# Altium project nira_avr_dev_board.PrjPcb (part 1 of 2)
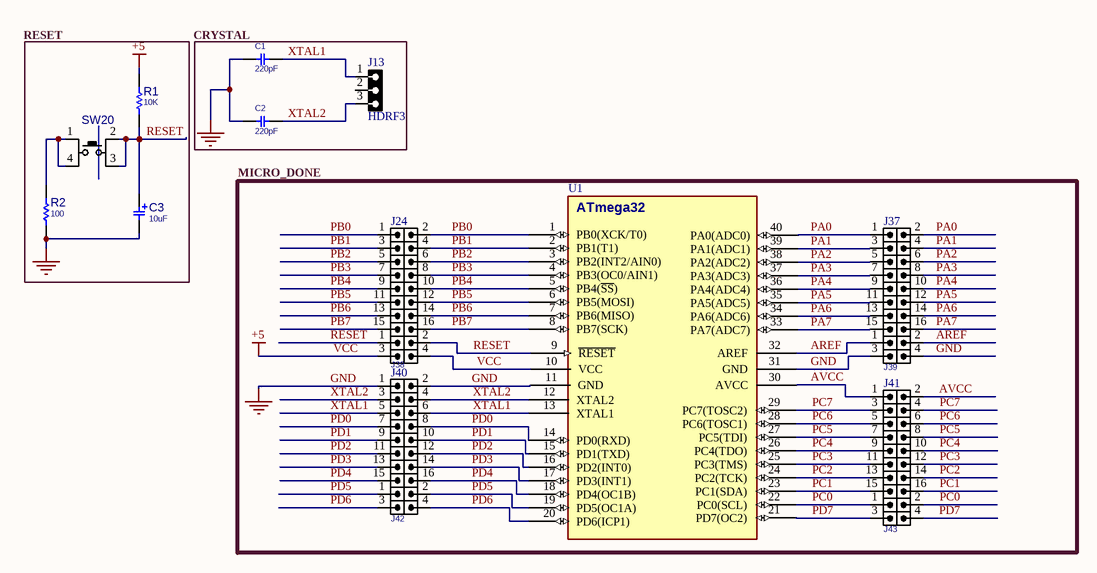
[diagram p0: main.SchDoc]
25 sheets, 197 parts. Net scope: global (net labels, ports and power ports of the same name join across sheets).
Board file: main.PcbDoc
Sheets:
  main.SchDoc
  rs232_usart.SchDoc
  stepper_motor.SchDoc
  dc_motor.SchDoc
  relay.SchDoc
  lcd_16_2.SchDoc
  glcd_128_64.SchDoc
  seven_segment.SchDoc
  push_button.SchDoc
  keypad.SchDoc
  pull_up_pull_down_switch.SchDoc
  temp_lm35.SchDoc
  buzzer.SchDoc
  led.SchDoc
  eeprom.SchDoc
  rtc.SchDoc
  rgb_led.SchDoc
  mmc_sd.SchDoc
  ps2_connector.SchDoc
  infra_red.SchDoc
  digital_pot.SchDoc
  phase_locked_loop.SchDoc
  rs485.SchDoc
  power.SchDoc
  programmer.SchDoc

## Sheet main.SchDoc
size A4; Engineer: Amir Hossein Jobeiri; Organization: Simaran; SheetNumber: 1; SheetTotal: 25

### Parts
C1  220pF  [C_CER_D3]
C2  220pF  [C_CER_D3]
C3  10uF  [C_EL_8X12]
J13  HDRF3  [HDR_F_1X3]
J24  HDRM_2X8  [HDR_M_2X8]  (value not drawn)
J37  HDRM_2X8  [HDR_M_2X8]  (value not drawn)
J38  HDRM_2X2  [HDR_M_2X2]  (value not drawn)
J39  HDRM_2X2  [HDR_M_2X2]  (value not drawn)
J40  HDRM_2X8  [HDR_M_2X8]  (value not drawn)
J41  HDRM_2X8  [HDR_M_2X8]  (value not drawn)
J42  HDRM_2X2  [HDR_M_2X2]  (value not drawn)
J43  HDRM_2X2  [HDR_M_2X2]  (value not drawn)
R1  10K  [R025W_AX04]
R2  100  [R025W_AX04]
SW20  PUSHBUTTON  [SWPBT_SPDT_6X6X5]  (value not drawn)
U1  ATMEGA32  [DIP_40DW]  (value not drawn)

### Blocks framed on the sheet
RESET: C3 R1 R2 SW20
CRYSTAL: C1 C2 J13
MICRO_DONE: J24 J37-J43 U1

### Nets
+5: J38.3 J38.4 R1.2 U1.10(VCC)  [also labelled VCC]  [project net LEDA_]
GND: C1.2 C2.2 C3.2 J39.3 J39.4 J40.1 J40.2 R2.1 U1.11(GND) U1.31(GND)
AREF: J39.1 J39.2 U1.32(AREF)
AVCC: J41.1 J41.2 U1.30(AVCC)
PA0: J37.1 J37.2 U1.40(PA0(ADC0))
PA1: J37.3 J37.4 U1.39(PA1(ADC1))
PA2: J37.5 J37.6 U1.38(PA2(ADC2))
PA3: J37.7 J37.8 U1.37(PA3(ADC3))
PA4: J37.9 J37.10 U1.36(PA4(ADC4))
PA5: J37.11 J37.12 U1.35(PA5(ADC5))
PA6: J37.13 J37.14 U1.34(PA6(ADC6))
PA7: J37.15 J37.16 U1.33(PA7(ADC7))
PB0: J24.1 J24.2 U1.1(PB0(XCK/T0))
PB1: J24.3 J24.4 U1.2(PB1(T1))
PB2: J24.5 J24.6 U1.3(PB2(INT2/AIN0))
PB3: J24.7 J24.8 U1.4(PB3(OC0/AIN1))
PB4: J24.9 J24.10 U1.5(PB4(~{SS}))
PB5: J24.11 J24.12 U1.6(PB5(MOSI))
PB6: J24.13 J24.14 U1.7(PB6(MISO))
PB7: J24.15 J24.16 U1.8(PB7(SCK))
PC0: J43.1 J43.2 U1.22(PC0(SCL))
PC1: J41.15 J41.16 U1.23(PC1(SDA))
PC2: J41.13 J41.14 U1.24(PC2(TCK))
PC3: J41.11 J41.12 U1.25(PC3(TMS))
PC4: J41.9 J41.10 U1.26(PC4(TDO))
PC5: J41.7 J41.8 U1.27(PC5(TDI))
PC6: J41.5 J41.6 U1.28(PC6(TOSC1))
PC7: J41.3 J41.4 U1.29(PC7(TOSC2))
PD0: J40.7 J40.8 U1.14(PD0(RXD))
PD1: J40.9 J40.10 U1.15(PD1(TXD))
PD2: J40.11 J40.12 U1.16(PD2(INT0))
PD3: J40.13 J40.14 U1.17(PD3(INT1))
PD4: J40.15 J40.16 U1.18(PD4(OC1B))
PD5: J42.1 J42.2 U1.19(PD5(OC1A))
PD6: J42.3 J42.4 U1.20(PD6(ICP1))
PD7: J43.3 J43.4 U1.21(PD7(OC2))
RESET: C3.1 J38.1 J38.2 R1.1 SW20.2(P3) SW20.3(P4) U1.9(~{RESET})
XTAL1: C1.1 J13.1 J40.5 J40.6 U1.13(XTAL1)
XTAL2: C2.1 J13.3 J40.3 J40.4 U1.12(XTAL2)
NetR2_2: R2.2 SW20.1(P1) SW20.4(P2)

Not connected (* = marked no-connect by the designer): J13 2

### Notes on the sheet
- (in symbol ATMEGA32A_DIP40) ATmega32

### Library data of the parts
C1 C2 = CAP_THD_CERML: CAP, THD, CER MULTI LAYER,; PARAM: 50V; DESC: CAP, CER MULTI LAYER,; MANF_P#: MANF_PART#; PRICE: 100= 1$; MANF: MANF; PARAM2: PARAM2; ASSEMBLY: ASSEMBLY; VALUE: 220pF
C3 = CAP_THD_EL: CAP, THD, ELEC,; MANF_P#: MANF_PART#; PARAM2: 25V; DESC: DESCRIPTION; DIST#: MOUSER; PARAM: 20%; PRICE: 10= 5$; MANF: MANF; ASSEMBLY: ASSEMBLY; VALUE: 10uF
J13 = HDR_F_1X3: CONN, HEADER, Female, pitch: 2.54mm, 3POS; VALUE: HDRF3
J24 J37 J40 J41 = HDR_M_2X8: CONN, HEADER, Male, pitch: 2.54mm, 16POS; VALUE: HDRM_2X8
J38 J39 J42 J43 = HDR_M_2X2: CONN, HEADER, Male, pitch: 2.54mm, 4POS; MANF_P#: MANF_PART#; MANF: MANF; VALUE: HDRM_2X2
R1 R2 = RES_THD: RESISTOR, THD; MANF_P#: RK73H1ETTP4701F; MANF: KOA SPEER; PARAM: 0.063W; DESC: DESCRIPTION; DIST#: MOUSER; PARAM2: 1%; ASSEMBLY: ASSEMBLY; PRICE: 100= 0.5$
  R1: VALUE: 10K
  R2: VALUE: 100
SW20 = SWPBT_SPDT_6X6X5: SWITCH, PUSH BUTTON, TACTILE, THD, SPDT, 4X4MM; DESC: DESCRIPTION; MANF: -; VALUE: PUSHBUTTON; ASSEMBLY: ASSEMBLY; PARAM: PARAM; PRICE: PRICE; MANF_P#: -
U1 = ATMEGA32A_DIP40: MCU, AVR, 8-Bit, 32KB, 2KB RAM, 16MHz; MANF_P#: ATMEGA32A-PU; DESC: 1KB EEPROM; MANF: ATMEL/MICROCHIP; PARAM2: 2.7~5.5V; PARAM: 32KB, 2KB RAM, 16MHz, -40~85°C; PRICE: 3.5$; VALUE: ATMEGA32

## Sheet rs232_usart.SchDoc
size A4; Engineer: Amir Hossein Jobeiri; Organization: Simaran; SheetNumber: 2; SheetTotal: 25
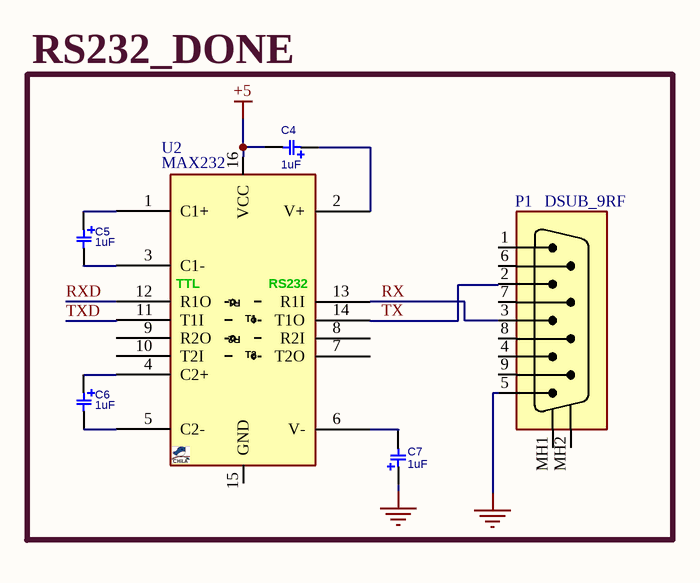
[diagram p1: rs232_usart.SchDoc]

### Parts
C4  1uF  [C_EL_4X7]
C5  1uF  [C_EL_4X7]
C6  1uF  [C_EL_4X7]
C7  1uF  [C_EL_4X7]
P1  DSUB_9RF  [DSUB_9RF]
U2  MAX232  [DIP_16]

### Blocks framed on the sheet
RS232_DONE: C4-C7 P1 U2

### Nets
+5: C4.2 U2.16(VCC)  [project net LEDA_]
GND: C7.1 P1.5
RX: P1.3 U2.13(R1I)
RXD: U2.12(R1O)
TX: P1.2 U2.14(T1O)
TXD: U2.11(T1I)
NetC4_1: C4.1 U2.2(V+)
NetC5_1: C5.1 U2.1(C1+)
NetC5_2: C5.2 U2.3(C1-)
NetC6_1: C6.1 U2.4(C2+)
NetC6_2: C6.2 U2.5(C2-)
NetC7_2: C7.2 U2.6(V-)

Not connected (* = marked no-connect by the designer): P1 1 4 6 7 8 9 MH1 MH2; U2 7(T2O) 8(R2I) 9(R2O) 10(T2I) 15(GND)

### Notes on the sheet
- (in symbol MAX232_DIP16) TTL; RS232; R1; T1; R2; T2

### Library data of the parts
C4-C7 = CAP_THD_EL_10u25V: CAP, THD, ELEC, 10uF, 25V; MANF_P#: MANF_PART#; PARAM: 25V; MANF: MANF; PARAM2: PARAM2; VALUE: 1uF
P1 = CONN_DSUB_9RF: CONN, DSUB, HD, 9PIN, R/A, FEMALE, THD; MANF_P#: -; MANF: -; VALUE: DSUB_9RF
U2 = MAX232_DIP16: RS-232, DUAL, +5V, Driver/Receiver; MANF_PART#: MAX232N, MAX232ACPE; MANF: Texas Instruments, Maxim Integrated; PARAM: PARAM; PRICE: 1500toman@PAYA; VALUE: MAX232

## Sheet stepper_motor.SchDoc
size A4; Engineer: Amir Hossein Jobeiri; Organization: Simaran; SheetNumber: 3; SheetTotal: 25
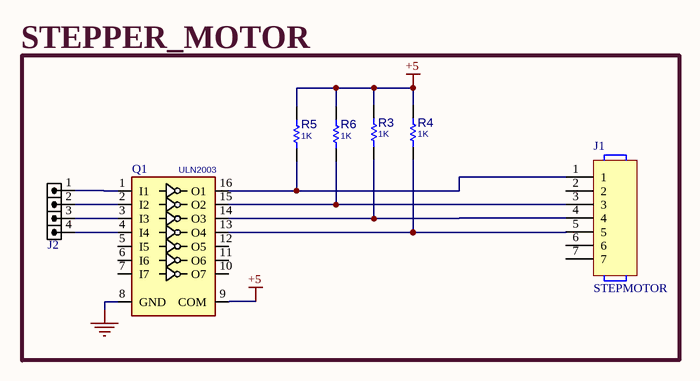
[diagram p2: stepper_motor.SchDoc]

### Parts
J1  STEPMOTOR
J2  HDR1X4  [HDRMINI_M_1X4]  (value not drawn)
Q1  ULN2003  [DIP_16]
R3  1K  [R025W_AX04]
R4  1K  [R025W_AX04]
R5  1K  [R025W_AX04]
R6  1K  [R025W_AX04]

### Blocks framed on the sheet
STEPPER_MOTOR: J1 J2 Q1 R3-R6

### Nets
+5: Q1.9(COM) R3.1 R4.1 R5.1 R6.1  [project net LEDA_]
GND: Q1.8(GND)
NetJ1_1: J1.1 Q1.16(O1) R5.2
NetJ1_3: J1.3 Q1.15(O2) R6.2
NetJ1_4: J1.4 Q1.14(O3) R3.2
NetJ1_5: J1.5 Q1.13(O4) R4.2
NetJ2_1: J2.1 Q1.1(I1)
NetJ2_2: J2.2 Q1.2(I2)
NetJ2_3: J2.3 Q1.3(I3)
NetJ2_4: J2.4 Q1.4(I4)

Not connected (* = marked no-connect by the designer): J1 2 6 7; Q1 5(I5) 6(I6) 7(I7) 10(O7) 11(O6) 12(O5)

### Library data of the parts
J1 = STEP_MOTOR_CONNECTOR: VALUE: STEPMOTOR; PARAM1: *; PARAM: *; Parameter 1: *
J2 = HDRMINI_M_1X4: CONN, HEADER, Male, pitch: 1.27mm, 4POS; VALUE: HDRMINI_4
Q1 = ULN2003_DIP16: Darlington, 7-CH, 50V, 0.5A; MANF_P#: ULN2003A; MANF: DIODES; PARAM: 7-CH, 50V, 0.5A; PARAM2: -; VALUE: ULN2003
R3-R6 = RES_THD: as R1 on sheet main; ASSEMBLY: ASSEMBLY; PRICE: 100= 0.5$; VALUE: 1K

## Sheet dc_motor.SchDoc
size A4; Engineer: Amir Hossein Jobeiri; Organization: Simaran; SheetNumber: 4; SheetTotal: 24
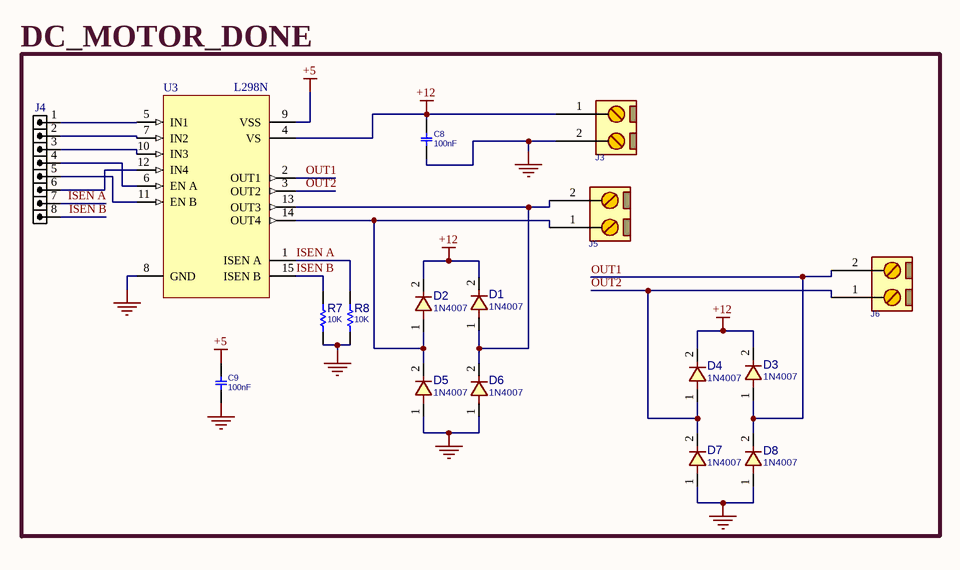
[diagram p3: dc_motor.SchDoc]

### Parts
C8  100nF  [C_CER_D3]
C9  100nF  [C_CER_D3]
D1  1N4007  [D_AX04_DO41]
D2  1N4007  [D_AX04_DO41]
D3  1N4007  [D_AX04_DO41]
D4  1N4007  [D_AX04_DO41]
D5  1N4007  [D_AX04_DO41]
D6  1N4007  [D_AX04_DO41]
D7  1N4007  [D_AX04_DO41]
D8  1N4007  [D_AX04_DO41]
J3  CONN_TB2  [TBG_2]  (value not drawn)
J4  HDR1X8  [HDR_M_1X8]  (value not drawn)
J5  CONN_TB2  [TBG_2]  (value not drawn)
J6  CONN_TB2  [TBG_2]  (value not drawn)
R7  10K  [R025W_AX04]
R8  10K  [R025W_AX04]
U3  L298N  [MULTIWATT_15V]

### Blocks framed on the sheet
DC_MOTOR_DONE: C8 C9 D1-D8 J3-J6 R7 R8 U3

### Nets
+5: C9.2 U3.9(VSS)  [project net LEDA_]
+12: C8.2 D1.2 D2.2 D3.2 D4.2 J3.1 U3.4(VS)
GND: C8.1 C9.1 D5.1 D6.1 D7.1 D8.1 J3.2 R7.2 R8.2 U3.8(GND)
ISEN A: J4.7 R8.1 U3.1(ISEN_A)
ISEN B: J4.8 R7.1 U3.15(ISEN_B)
OUT1: D3.1 D8.2 J6.2 U3.2(OUT1)
OUT2: D4.1 D7.2 J6.1 U3.3(OUT2)
NetD1_1: D1.1 D6.2 J5.2 U3.13(OUT3)
NetD2_1: D2.1 D5.2 J5.1 U3.14(OUT4)
NetJ4_1: J4.1 U3.5(IN1)
NetJ4_2: J4.2 U3.7(IN2)
NetJ4_3: J4.3 U3.10(IN3)
NetJ4_4: J4.4 U3.6(EN_A)
NetJ4_5: J4.5 U3.11(EN_B)
NetJ4_6: J4.6 U3.12(IN4)

### Library data of the parts
C8 C9 = CAP_THD_CERML: as C1 on sheet main; PRICE: 100= 1$; MANF: MANF; PARAM2: PARAM2; ASSEMBLY: ASSEMBLY; VALUE: 100nF
D1-D8 = DIODE_SMD_1N4007: DIODE, GENERAL PURPOSE, 1000V/1A; MANF: Kingtronics; DESC: DESCRIPTION; PARAM: 1000V VRRM; PARAM2: 1A; MANF_P#: M7; ASSEMBLY: ASSEMBLY; PRICE: PRICE; VALUE: 1N4007
J3 J5 J6 = CONN_TB2: CONN, TERMINAL BLOCK, 5.08mm pitch; VALUE: CONN_TB2
J4 = HDR_M_1X8: CONN, HEADER, Male, pitch: 2.54mm, 8POS; VALUE: HDRM8
R7 R8 = RES_THD: as R1 on sheet main; ASSEMBLY: ASSEMBLY; PRICE: 100= 0.5$; VALUE: 10K
U3 = L298N: CREATED BY J; VALUE: L298N; PARAM: *; PARAM2: *; MANF: *; MANF_P#: *

## Sheet relay.SchDoc
size A4; Engineer: Amir Hossein Jobeiri; Organization: Simaran; SheetNumber: 5; SheetTotal: 24
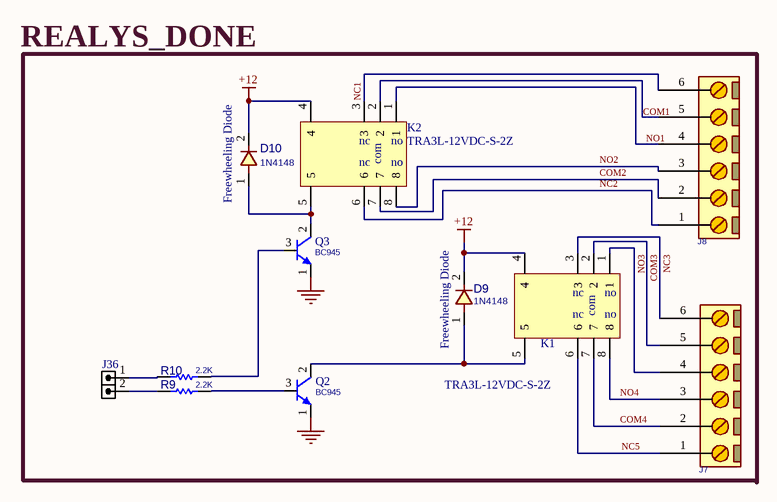
[diagram p4: relay.SchDoc]

### Parts
D9  1N4148  [D_AX02_DO35]
D10  1N4148  [D_AX02_DO35]
J7  CONN_TB6  [TBG_6]  (value not drawn)
J8  CONN_TB6  [TBG_6]  (value not drawn)
J36  HDRM2  [HDR_M_1X2]  (value not drawn)
K1  TRA3L-12VDC-S-2Z  [TR3_RELAY_TIANBO]
K2  TRA3L-12VDC-S-2Z  [TR3_RELAY_TIANBO]
Q2  BC945  [TO92_3]
Q3  BC945  [TO92_3]
R9  2.2K  [R025W_AX04]
R10  2.2K  [R025W_AX04]

### Nets
+12: D9.2 D10.2 K1.4 K2.4
GND: Q2.1(E) Q3.1(E)
COM2: J8.2 K2.7
COM3: J7.5 K1.2
COM4: J7.2 K1.7
NC1: J8.6 K2.3
NC2: J8.1 K2.6
NC3: J7.6 K1.3
NC5: J7.1 K1.6
NO2: J8.3 K2.8
NO3: J7.4 K1.1
NO4: J7.3 K1.8
NetD9_1: D9.1 K1.5 Q2.2(C)
NetD10_1: D10.1 K2.5 Q3.2(C)
NetJ8_4: J8.4 K2.1
NetJ8_5: J8.5 K2.2
NetJ36_1: J36.1 R10.1
NetJ36_2: J36.2 R9.1
NetQ2_3: Q2.3(B) R9.2
NetQ3_3: Q3.3(B) R10.2

### Notes on the sheet
- REALYS_DONE
- (near D10) Freewheeling Diode
- (near D9) Freewheeling Diode
- Labels drawn without touching a wire or pin: COM1, NO1
- (in symbol RELAY_TRA3) nc; no; com

### Library data of the parts
D9 D10 = DIODE_THD_1N4148_DO35: DIODE, FAST SWTICHING, THD; DESC: DESCRIPTION; PARAM: 75V; PARAM2: 0.3A; MANF: MANF; ASSEMBLY: ASSEMBLY; PRICE: PRICE; MANF_P#: 1N4148; VALUE: 1N4148
J7 J8 = CONN_TB6: CONN, TERMINAL BLOCK, 5.08mm pitch; VALUE: CONN_TB6
J36 = HDR_M_1X2: CONN, HEADER, Male, pitch: 2.54mm, 2POS; VALUE: HDRM2
K1 K2 = RELAY_TRA3: MANF: TIANBO; VALUE: TRA3L-12VDC-S-2Z; MANF_P#: *; PARAM1: *; PARAM2: *
Q2 Q3 = NPN_BC945_TO92: BJT, NPN, 50v, 0.15A, THD, TO92, BC945; PARAM2: 250mW; MANF_P#: 2SC945, BC945; PARAM: 50v, 0.15A; MANF: -; VALUE: BC945
R9 R10 = RES_THD: as R1 on sheet main; ASSEMBLY: ASSEMBLY; PRICE: 100= 0.5$; VALUE: 2.2K

## Sheet lcd_16_2.SchDoc
size A4; Engineer: Amir Hossein Jobeiri; Organization: Simaran; SheetNumber: 6; SheetTotal: 23
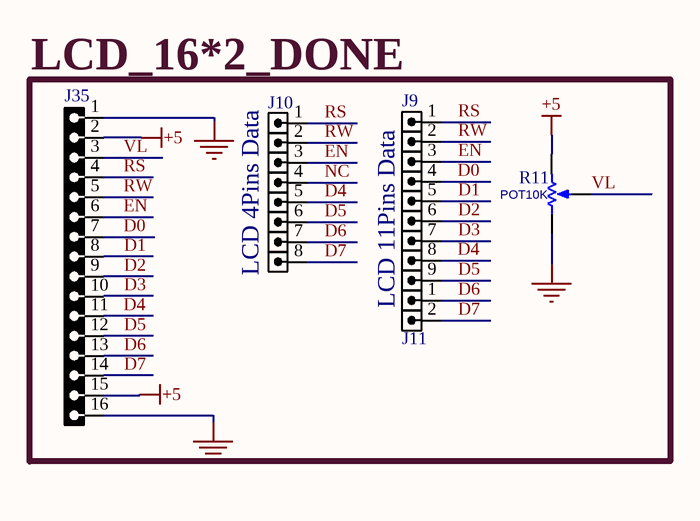
[diagram p5: lcd_16_2.SchDoc]

### Parts
J9  HDR1X9  [HDR_M_1X9]  (value not drawn)
J10  HDR1X8  [HDR_M_1X8]  (value not drawn)
J11  HDRM2  [HDR_M_1X2]  (value not drawn)
J35  HDRF16  [HDR_F_1X16]  (value not drawn)
R11  POT10K  [POT_7X5]

### Nets
+5: J35.2 J35.15 R11.3(BOT)  [project net LEDA_]
GND: J35.1 J35.16 R11.1(TOP)
D0: J9.4 J35.7
D1: J9.5 J35.8
D2: J9.6 J35.9
D3: J9.7 J35.10
D4: J9.8 J10.5 J35.11
D5: J9.9 J10.6 J35.12
D6: J10.7 J11.1 J35.13
D7: J10.8 J11.2 J35.14
EN: J9.3 J10.3 J35.6
NC: J10.4
RS: J9.1 J10.1 J35.4
RW: J9.2 J10.2 J35.5
VL: J35.3 R11.2(TAP)

### Notes on the sheet
- LCD_16*2_DONE
- (near J10) LCD 4Pins Data
- LCD 11Pins Data

### Library data of the parts
J9 = HDR_M_1X9: CONN, HEADER, Male, pitch: 2.54mm, 9POS; VALUE: HDRM9
J10 = HDR_M_1X8: as J4 on sheet dc_motor
J11 = HDR_M_1X2: CONN, HEADER, Male, pitch: 2.54mm, 2POS; VALUE: HDRM2
J35 = HDR_F_1X16: CONN, HEADER, Female, pitch: 2.54mm, 16POS; VALUE: HDRF16
R11 = RES_THD_POT_7X5: RESISTOR, THD, Potentiometer; VALUE: POT10K

## Sheet glcd_128_64.SchDoc
size A4; Engineer: Amir Hossein Jobeiri; Organization: Simaran; SheetNumber: 7; SheetTotal: 23
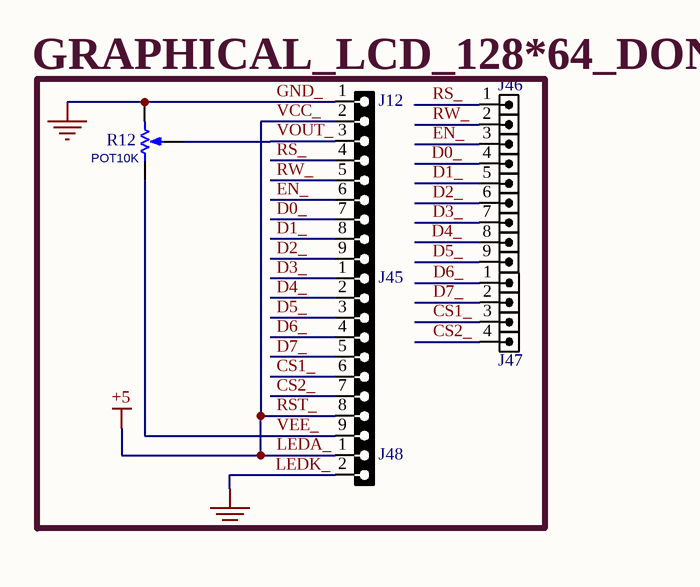
[diagram p6: glcd_128_64.SchDoc]

### Parts
J12  HDRF9  [HDR_F_1X9]  (value not drawn)
J45  HDRF9  [HDR_F_1X9]  (value not drawn)
J46  HDR1X9  [HDR_M_1X9]  (value not drawn)
J47  HDR1X4  [HDR_M_1X4]  (value not drawn)
J48  HDRF2  [HDR_F_1X2]  (value not drawn)
R12  POT10K  [POT_7X5]

### Nets
GND: J12.1 J48.2 R12.3(BOT)  [also labelled GND_, LEDK_]
LEDA_: J12.2 J45.8 J48.1  [also labelled +5, RST_, VCC_]
CS1_: J45.6 J47.3
CS2_: J45.7 J47.4
D0_: J12.7 J46.4
D1_: J12.8 J46.5
D2_: J12.9 J46.6
D3_: J45.1 J46.7
D4_: J45.2 J46.8
D5_: J45.3 J46.9
D6_: J45.4 J47.1
D7_: J45.5 J47.2
EN_: J12.6 J46.3
RS_: J12.4 J46.1
RW_: J12.5 J46.2
VEE_: J45.9 R12.1(TOP)
VOUT_: J12.3 R12.2(TAP)

### Notes on the sheet
- GRAPHICAL_LCD_128*64_DONE

### Library data of the parts
J12 J45 = HDR_F_1X9: CONN, HEADER, Female, pitch: 2.54mm, 9POS; VALUE: HDRF9
J46 = HDR_M_1X9: as J9 on sheet lcd_16_2
J47 = HDR_M_1X4: CONN, HEADER, Male, pitch: 2.54mm, 4POS; VALUE: HDRM4
J48 = HDR_F_1X2: CONN, HEADER, Female, pitch: 2.54mm, 2POS; VALUE: HDRF2
R12 = RES_THD_POT_7X5: RESISTOR, THD, Potentiometer; VALUE: POT10K

## Sheet seven_segment.SchDoc
size A4; Engineer: Amir Hossein Jobeiri; Organization: Simaran; SheetNumber: 8; SheetTotal: 24
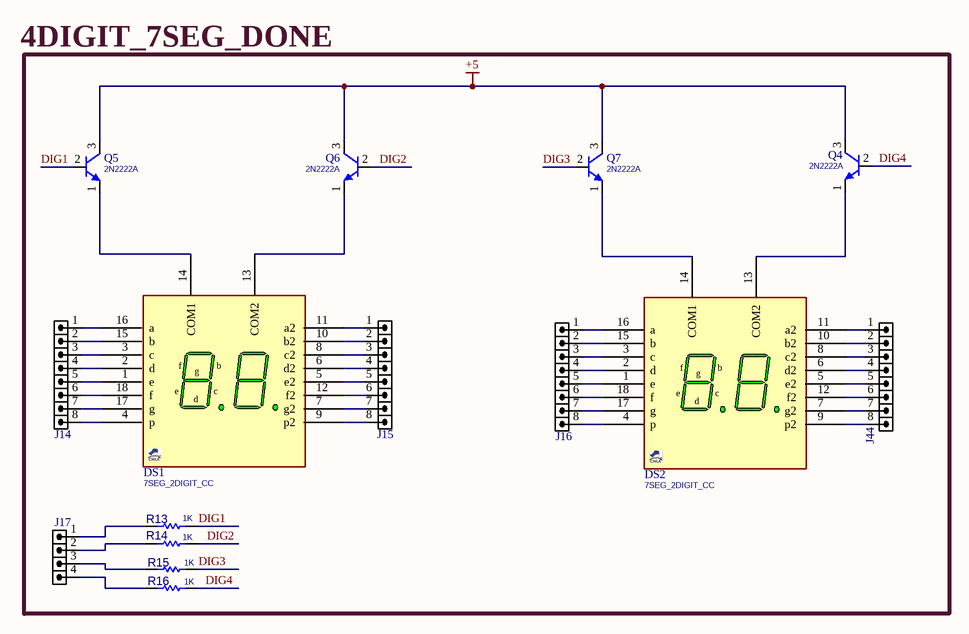
[diagram p7: seven_segment.SchDoc]

### Parts
DS1  7SEG_2DIGIT_CC  [7SEGX2_16]
DS2  7SEG_2DIGIT_CC  [7SEGX2_16]
J14  HDR1X8  [HDR_M_1X8]  (value not drawn)
J15  HDR1X8  [HDR_M_1X8]  (value not drawn)
J16  HDR1X8  [HDR_M_1X8]  (value not drawn)
J17  HDR1X4  [HDR_M_1X4]  (value not drawn)
J44  HDR1X8  [HDR_M_1X8]  (value not drawn)
Q4  2N2222A  [TO92_3]
Q5  2N2222A  [TO92_3]
Q6  2N2222A  [TO92_3]
Q7  2N2222A  [TO92_3]
R13  1K  [R025W_AX04]
R14  1K  [R025W_AX04]
R15  1K  [R025W_AX04]
R16  1K  [R025W_AX04]

### Nets
+5: Q4.3(C) Q5.3(C) Q6.3(C) Q7.3(C)  [project net LEDA_]
DIG1: Q5.2(B) R13.1
DIG2: Q6.2(B) R14.1
DIG3: Q7.2(B) R15.1
DIG4: Q4.2(B) R16.1
NetDS1_1: DS1.1(e) J14.5
NetDS1_2: DS1.2(d) J14.4
NetDS1_3: DS1.3(c) J14.3
NetDS1_4: DS1.4(p) J14.8
NetDS1_5: DS1.5(e2) J15.5
NetDS1_6: DS1.6(d2) J15.4
NetDS1_7: DS1.7(g2) J15.7
NetDS1_8: DS1.8(c2) J15.3
NetDS1_9: DS1.9(p2) J15.8
NetDS1_10: DS1.10(b2) J15.2
NetDS1_11: DS1.11(a2) J15.1
NetDS1_12: DS1.12(f2) J15.6
NetDS1_13: DS1.13(COM2) Q6.1(E)
NetDS1_14: DS1.14(COM1) Q5.1(E)
NetDS1_15: DS1.15(b) J14.2
NetDS1_16: DS1.16(a) J14.1
NetDS1_17: DS1.17(g) J14.7
NetDS1_18: DS1.18(f) J14.6
NetDS2_1: DS2.1(e) J16.5
NetDS2_2: DS2.2(d) J16.4
NetDS2_3: DS2.3(c) J16.3
NetDS2_4: DS2.4(p) J16.8
NetDS2_5: DS2.5(e2) J44.5
NetDS2_6: DS2.6(d2) J44.4
NetDS2_7: DS2.7(g2) J44.7
NetDS2_8: DS2.8(c2) J44.3
NetDS2_9: DS2.9(p2) J44.8
NetDS2_10: DS2.10(b2) J44.2
NetDS2_11: DS2.11(a2) J44.1
NetDS2_12: DS2.12(f2) J44.6
NetDS2_13: DS2.13(COM2) Q4.1(E)
NetDS2_14: DS2.14(COM1) Q7.1(E)
NetDS2_15: DS2.15(b) J16.2
NetDS2_16: DS2.16(a) J16.1
NetDS2_17: DS2.17(g) J16.7
NetDS2_18: DS2.18(f) J16.6
NetJ17_1: J17.1 R13.2
NetJ17_2: J17.2 R14.2
NetJ17_3: J17.3 R15.2
NetJ17_4: J17.4 R16.2

### Notes on the sheet
- 4DIGIT_7SEG_DONE

### Library data of the parts
DS1 DS2 = 7SEG_2DIGIT_CC: 7SEGMENT, 2DIGIT, common cathode; VALUE: 7SEG_2DIGIT_CC
J14-J16 J44 = HDR_M_1X8: as J4 on sheet dc_motor
J17 = HDR_M_1X4: as J47 on sheet glcd_128_64
Q4-Q7 = NPN_2N2222A_TO92: BJT, NPN, 40v, 0.6A, THD, TO92; PARAM: 0.6A, hFE100~300; PARAM2: 40v, 625mW; MANF: DIOTEC; MANF_P#: 2N2222A; VALUE: 2N2222A
R13-R16 = RES_THD: as R1 on sheet main; ASSEMBLY: ASSEMBLY; PRICE: 100= 0.5$; VALUE: 1K

## Sheet push_button.SchDoc
size A4; Engineer: Amir Hossein Jobeiri; Organization: Simaran; SheetNumber: 9; SheetTotal: 23
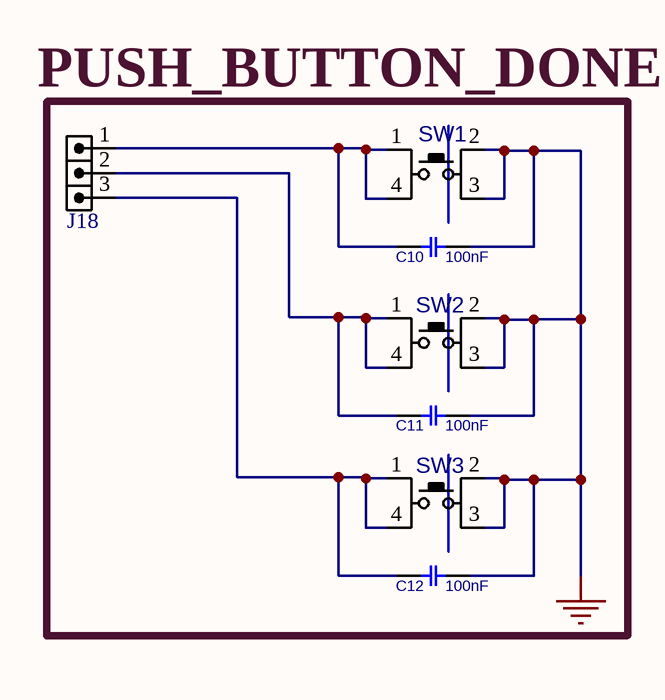
[diagram p8: push_button.SchDoc]

### Parts
C10  100nF  [C_CER_D3]
C11  100nF  [C_CER_D3]
C12  100nF  [C_CER_D3]
J18  HDRMINI_3  [HDRMINI_M_1X3]  (value not drawn)
SW1  PUSHBUTTON  [SWPBT_SPDT_6X6X5]  (value not drawn)
SW2  PUSHBUTTON  [SWPBT_SPDT_6X6X5]  (value not drawn)
SW3  PUSHBUTTON  [SWPBT_SPDT_6X6X5]  (value not drawn)

### Nets
GND: C10.2 C11.2 C12.2 SW1.2(P3) SW1.3(P4) SW2.2(P3) SW2.3(P4) SW3.2(P3) SW3.3(P4)
NetC10_1: C10.1 J18.1 SW1.1(P1) SW1.4(P2)
NetC11_1: C11.1 J18.2 SW2.1(P1) SW2.4(P2)
NetC12_1: C12.1 J18.3 SW3.1(P1) SW3.4(P2)

### Notes on the sheet
- PUSH_BUTTON_DONE

### Library data of the parts
C10-C12 = CAP_THD_CERML: as C1 on sheet main; PRICE: 100= 1$; MANF: MANF; PARAM2: PARAM2; ASSEMBLY: ASSEMBLY; VALUE: 100nF
J18 = HDRMINI_M_1X3: CONN, HEADER, Male, pitch: 1.27mm, 3POS; VALUE: HDRMINI_3
SW1-SW3 = SWPBT_SPDT_6X6X5: as SW20 on sheet main; MANF: -; VALUE: PUSHBUTTON; ASSEMBLY: ASSEMBLY; PARAM: PARAM; PRICE: PRICE; MANF_P#: -

## Sheet keypad.SchDoc
size A4; Engineer: Amir Hossein Jobeiri; Organization: Simaran; SheetNumber: 10; SheetTotal: 23
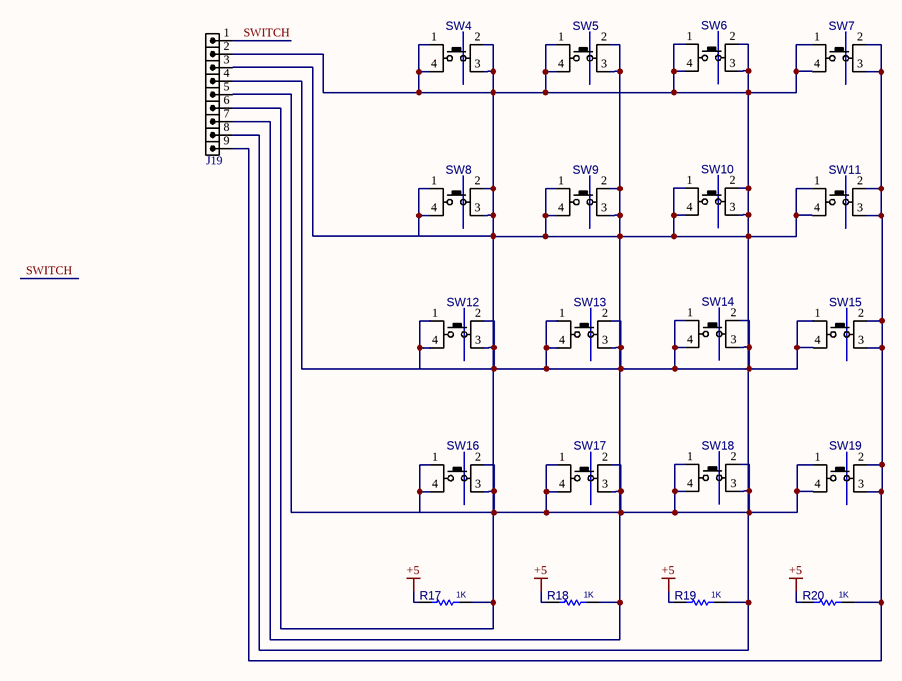
[diagram p9: keypad.SchDoc]

### Parts
J19  HDR1X9  [HDRMINI_M_1X9]  (value not drawn)
R17  1K  [R025W_AX04]
R18  1K  [R025W_AX04]
R19  1K  [R025W_AX04]
R20  1K  [R025W_AX04]
SW4  PUSHBUTTON  [SWPBT_SPDT_6X6X5]  (value not drawn)
SW5  PUSHBUTTON  [SWPBT_SPDT_6X6X5]  (value not drawn)
SW6  PUSHBUTTON  [SWPBT_SPDT_6X6X5]  (value not drawn)
SW7  PUSHBUTTON  [SWPBT_SPDT_6X6X5]  (value not drawn)
SW8  PUSHBUTTON  [SWPBT_SPDT_6X6X5]  (value not drawn)
SW9  PUSHBUTTON  [SWPBT_SPDT_6X6X5]  (value not drawn)
SW10  PUSHBUTTON  [SWPBT_SPDT_6X6X5]  (value not drawn)
SW11  PUSHBUTTON  [SWPBT_SPDT_6X6X5]  (value not drawn)
SW12  PUSHBUTTON  [SWPBT_SPDT_6X6X5]  (value not drawn)
SW13  PUSHBUTTON  [SWPBT_SPDT_6X6X5]  (value not drawn)
SW14  PUSHBUTTON  [SWPBT_SPDT_6X6X5]  (value not drawn)
SW15  PUSHBUTTON  [SWPBT_SPDT_6X6X5]  (value not drawn)
SW16  PUSHBUTTON  [SWPBT_SPDT_6X6X5]  (value not drawn)
SW17  PUSHBUTTON  [SWPBT_SPDT_6X6X5]  (value not drawn)
SW18  PUSHBUTTON  [SWPBT_SPDT_6X6X5]  (value not drawn)
SW19  PUSHBUTTON  [SWPBT_SPDT_6X6X5]  (value not drawn)

### Nets
+5: R17.2 R18.2 R19.2 R20.2  [project net LEDA_]
SWITCH: J19.1
NetJ19_2: J19.2 J19.3 J19.6 J19.7 J19.8 R17.1 R18.1 R19.1 SW4.1(P1) SW4.2(P3) SW4.3(P4) SW4.4(P2) SW5.1(P1) SW5.2(P3) SW5.3(P4) SW5.4(P2) SW6.1(P1) SW6.2(P3) SW6.3(P4) SW6.4(P2) SW7.1(P1) SW7.4(P2) SW8.1(P1) SW8.2(P3) SW8.3(P4) SW8.4(P2) SW9.1(P1) SW9.2(P3) SW9.3(P4) SW9.4(P2) SW10.1(P1) SW10.2(P3) SW10.3(P4) SW10.4(P2) SW11.1(P1) SW11.4(P2)
NetJ19_4: J19.4 SW12.1(P1) SW12.2(P3) SW12.3(P4) SW12.4(P2) SW13.1(P1) SW13.2(P3) SW13.3(P4) SW13.4(P2) SW14.1(P1) SW14.2(P3) SW14.3(P4) SW14.4(P2) SW15.1(P1) SW15.4(P2)
NetJ19_5: J19.5 SW16.1(P1) SW16.2(P3) SW16.3(P4) SW16.4(P2) SW17.1(P1) SW17.2(P3) SW17.3(P4) SW17.4(P2) SW18.1(P1) SW18.2(P3) SW18.3(P4) SW18.4(P2) SW19.1(P1) SW19.4(P2)
NetJ19_9: J19.9 R20.1 SW7.2(P3) SW7.3(P4) SW11.2(P3) SW11.3(P4) SW15.2(P3) SW15.3(P4) SW19.2(P3) SW19.3(P4)

### Library data of the parts
J19 = HDRMINI_M_1X9: CONN, HEADER, Male, pitch: 1.27mm, 9POS; VALUE: HDRMINI_9
R17-R20 = RES_THD: as R1 on sheet main; ASSEMBLY: ASSEMBLY; PRICE: 100= 0.5$; VALUE: 1K
SW4-SW19 = SWPBT_SPDT_6X6X5: as SW20 on sheet main; MANF: -; VALUE: PUSHBUTTON; ASSEMBLY: ASSEMBLY; PARAM: PARAM; PRICE: PRICE; MANF_P#: -

## Sheet pull_up_pull_down_switch.SchDoc
size A4; Engineer: Amir Hossein Jobeiri; Organization: Simaran; SheetNumber: 11; SheetTotal: 24
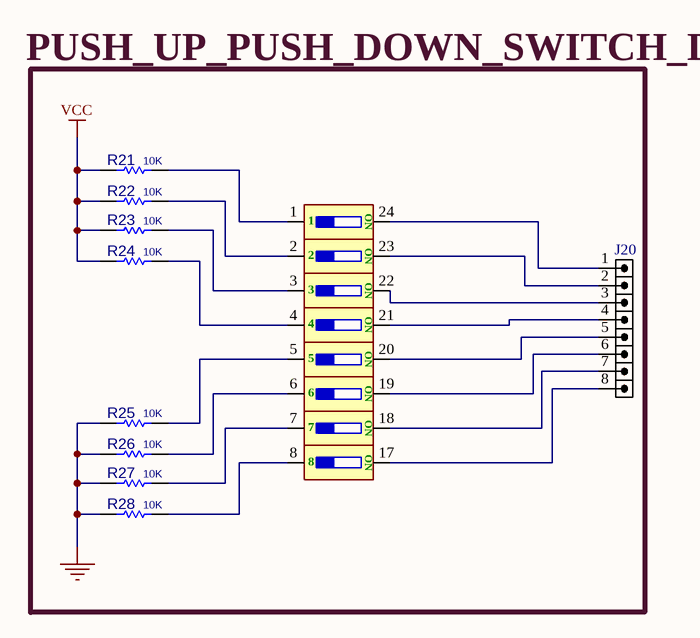
[diagram p10: pull_up_pull_down_switch.SchDoc]

### Parts
J20  HDR1X8  [HDR_M_1X8]  (value not drawn)
R21  10K  [R025W_AX04]
R22  10K  [R025W_AX04]
R23  10K  [R025W_AX04]
R24  10K  [R025W_AX04]
R25  10K  [R025W_AX04]
R26  10K  [R025W_AX04]
R27  10K  [R025W_AX04]
R28  10K  [R025W_AX04]
S2  DIPSW12  [DIPSW254T_12]  (value not drawn)  (parts A,B,C,D,E,F,G,H of 12)

### Nets
GND: R25.2 R26.2 R27.2 R28.2
VCC: R21.2 R22.2 R23.2 R24.2  [project net LEDA_]
NetJ20_1: J20.1 S2.24(B1)
NetJ20_2: J20.2 S2.23(B2)
NetJ20_3: J20.3 S2.22(B3)
NetJ20_4: J20.4 S2.21(B4)
NetJ20_5: J20.5 S2.20(B5)
NetJ20_6: J20.6 S2.19(B6)
NetJ20_7: J20.7 S2.18(B7)
NetJ20_8: J20.8 S2.17(B8)
NetR21_1: R21.1 S2.1(A1)
NetR22_1: R22.1 S2.2(A2)
NetR23_1: R23.1 S2.3(A3)
NetR24_1: R24.1 S2.4(A4)
NetR25_1: R25.1 S2.5(A5)
NetR26_1: R26.1 S2.6(A6)
NetR27_1: R27.1 S2.7(A7)
NetR28_1: R28.1 S2.8(A8)

### Notes on the sheet
- PUSH_UP_PUSH_DOWN_SWITCH_DONE
- (in symbol DIPSW254T_12P, part A) ON
- (in symbol DIPSW254T_12P, part B) ON
- (in symbol DIPSW254T_12P, part C) ON
- (in symbol DIPSW254T_12P, part D) ON
- (in symbol DIPSW254T_12P, part E) ON
- (in symbol DIPSW254T_12P, part F) ON
- (in symbol DIPSW254T_12P, part G) ON
- (in symbol DIPSW254T_12P, part H) ON

### Library data of the parts
J20 = HDR_M_1X8: as J4 on sheet dc_motor
R21-R28 = RES_THD: as R1 on sheet main; ASSEMBLY: ASSEMBLY; PRICE: 100= 0.5$; VALUE: 10K
S2 = DIPSW254T_12P: SWITCH, DIP, 12P, THD; MANF: MANF; MANF_P#: MANF_P#; VALUE: DIPSW12

## Sheet temp_lm35.SchDoc
size A4; Engineer: Amir Hossein Jobeiri; Organization: Simaran; SheetNumber: 12; SheetTotal: 24
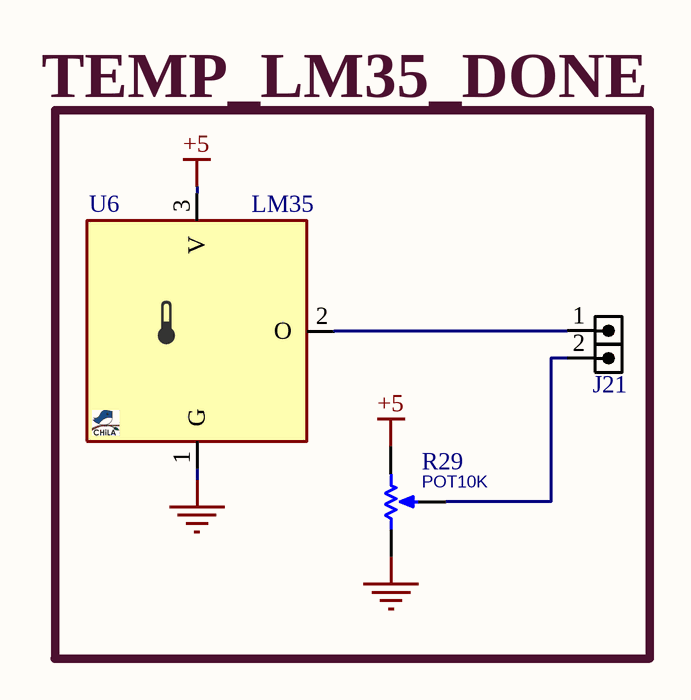
[diagram p11: temp_lm35.SchDoc]

### Parts
J21  HDRM2  [HDR_M_1X2]  (value not drawn)
R29  POT10K  [POT_3296W]
U6  LM35  [TO92_3]

### Nets
+5: R29.3(BOT) U6.3(V)  [project net LEDA_]
GND: R29.1(TOP) U6.1(G)
NetJ21_1: J21.1 U6.2(O)
NetJ21_2: J21.2 R29.2(TAP)

### Notes on the sheet
- (near U6) TEMP_LM35_DONE

### Library data of the parts
J21 = HDR_M_1X2: CONN, HEADER, Male, pitch: 2.54mm, 2POS; VALUE: HDRM2
R29 = RES_THD_POT_3296W: RESISTOR, THD, Potentiometer; VALUE: POT10K
U6 = TMP_LM35_TO92: SENSOR, TEMP, ANALOG, -55~150oC, 4~20Vcc, Out 0mV + 10mV/oC; MANF_P#: LM35CZ, LM35CAZ or LM35DZ; MANF: TI; PARAM: 0.5°C Accuracy, 10mV/oC, -55~150oC; PARAM2: 4~20Vcc; PRICE: 7$; VALUE: LM35

## Sheet buzzer.SchDoc
size A4; Engineer: Amir Hossein Jobeiri; Organization: Simaran; SheetNumber: 13; SheetTotal: 24
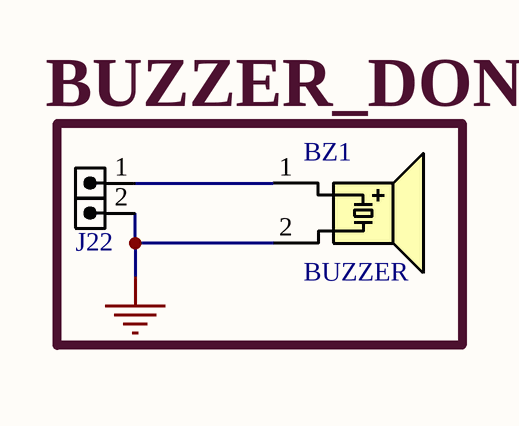
[diagram p12: buzzer.SchDoc]

### Parts
BZ1  BUZZER  [BZ_C9]
J22  HDRM2  [HDR_M_1X2]  (value not drawn)

### Nets
GND: BZ1.2(B) J22.2
NetBZ1_1: BZ1.1(A) J22.1

### Notes on the sheet
- BUZZER_DONE

### Library data of the parts
BZ1 = BUZZER_C9: Buzzer, 9mm, Magnetic Transducer; MANF: Mallory; MANF_P#: PB-09N23P-03Q; PARAM2: 3V, 30mA; PARAM: 2.7KHz; PRICE: $3; VALUE: BUZZER
J22 = HDR_M_1X2: CONN, HEADER, Male, pitch: 2.54mm, 2POS; VALUE: HDRM2

## Sheet led.SchDoc
size A4; Engineer: Amir Hossein Jobeiri; Organization: Simaran; SheetNumber: 14; SheetTotal: 24
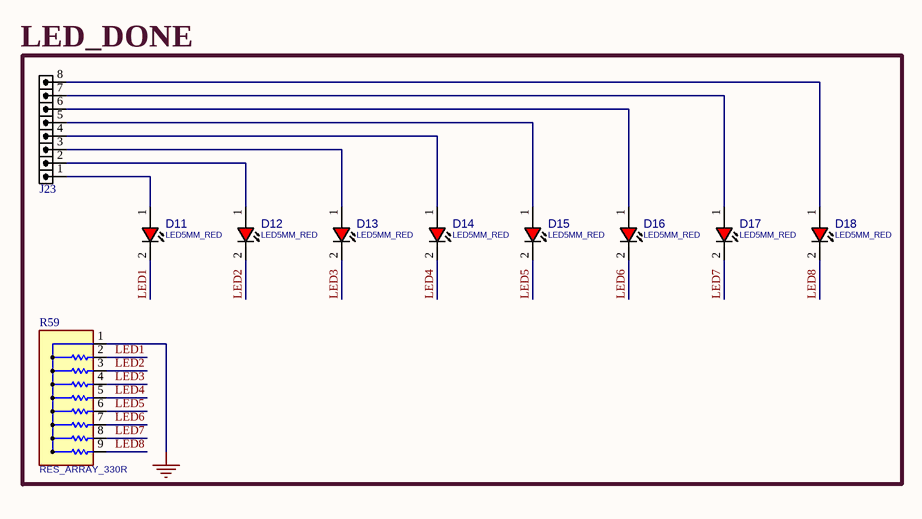
[diagram p13: led.SchDoc]

### Parts
D11  LED5MM_RED  [LED5MM_RED]
D12  LED5MM_RED  [LED5MM_RED]
D13  LED5MM_RED  [LED5MM_RED]
D14  LED5MM_RED  [LED5MM_RED]
D15  LED5MM_RED  [LED5MM_RED]
D16  LED5MM_RED  [LED5MM_RED]
D17  LED5MM_RED  [LED5MM_RED]
D18  LED5MM_RED  [LED5MM_RED]
J23  HDR1X8  [HDR_M_1X8]  (value not drawn)
R59  RES_ARRAY_330R  [RES_ARRAYX8]

### Blocks framed on the sheet
LED_DONE: D11-D18 J23 R59

### Nets
GND: R59.1
LED1: D11.2(CATHODE) R59.2
LED2: D12.2(CATHODE) R59.3
LED3: D13.2(CATHODE) R59.4
LED4: D14.2(CATHODE) R59.5
LED5: D15.2(CATHODE) R59.6
LED6: D16.2(CATHODE) R59.7
LED7: D17.2(CATHODE) R59.8
LED8: D18.2(CATHODE) R59.9
NetD11_1: D11.1(ANODE) J23.1
NetD12_1: D12.1(ANODE) J23.2
NetD13_1: D13.1(ANODE) J23.3
NetD14_1: D14.1(ANODE) J23.4
NetD15_1: D15.1(ANODE) J23.5
NetD16_1: D16.1(ANODE) J23.6
NetD17_1: D17.1(ANODE) J23.7
NetD18_1: D18.1(ANODE) J23.8

### Library data of the parts
D11-D18 = LED_THD_5MM_RED: LED, THD, 5MM, RED; DESC: DESCRIPTION; MANF_P#: MANF_PART#; PARAM2: 2.2V; MANF: MANF; ASSEMBLY: ASSEMBLY; PRICE: PRICE; VALUE: LED5MM_RED
J23 = HDR_M_1X8: as J4 on sheet dc_motor
R59 = RES_THD_ARRAY: RESISTOR, THD, Array, 8RES; VALUE: RES_ARRAY_330R

## Sheet eeprom.SchDoc
size A4; Engineer: Amir Hossein Jobeiri; Organization: Simaran; SheetNumber: 15; SheetTotal: 24
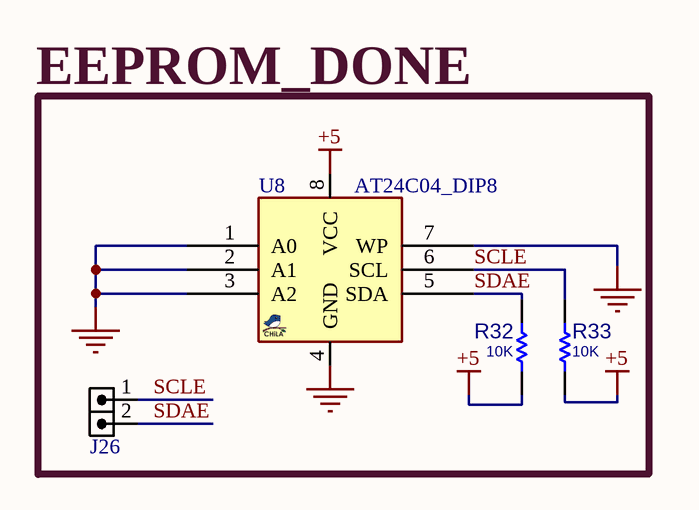
[diagram p14: eeprom.SchDoc]

### Parts
J26  HDRM2  [HDR_M_1X2]  (value not drawn)
R32  10K  [R025W_AX04]
R33  10K  [R025W_AX04]
U8  AT24C04_DIP8  [DIP_8]

### Blocks framed on the sheet
EEPROM_DONE: J26 R32 R33 U8

### Nets
+5: R32.2 R33.2 U8.8(VCC)  [project net LEDA_]
GND: U8.1(A0) U8.2(A1) U8.3(A2) U8.4(GND) U8.7(WP)
SCLE: J26.1 R33.1 U8.6(SCL)
SDAE: J26.2 R32.1 U8.5(SDA)

### Library data of the parts
J26 = HDR_M_1X2: CONN, HEADER, Male, pitch: 2.54mm, 2POS; VALUE: HDRM2
R32 R33 = RES_THD: as R1 on sheet main; ASSEMBLY: ASSEMBLY; PRICE: 100= 0.5$; VALUE: 10K
U8 = EEPROM_I2C_AT24C04_DIP8: VALUE: AT24C04_DIP8; PARAM: *; PARAM1: *; MANF: *; MANF_P#: *

## Sheet rtc.SchDoc
size A4; Engineer: Amir Hossein Jobeiri; Organization: Simaran; SheetNumber: 15; SheetTotal: 24
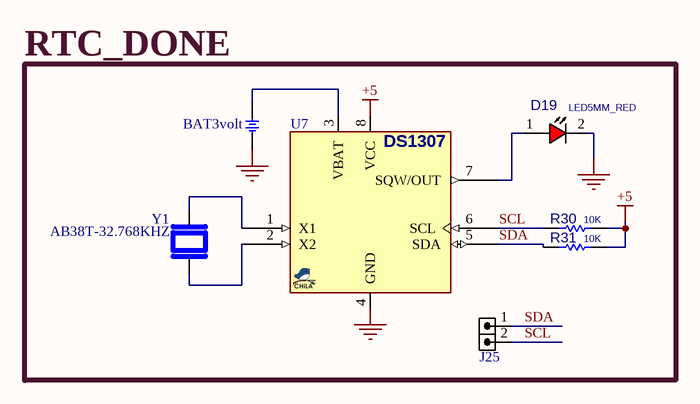
[diagram p15: rtc.SchDoc]

### Parts
BT1  BAT3volt  [BTH2032]
D19  LED5MM_RED  [LED5MM_RED]
J25  HDRM2  [HDR_M_1X2]  (value not drawn)
R30  10K  [R025W_AX04]
R31  10K  [R025W_AX04]
U7  DS1307  [DIP_8]  (value not drawn)
Y1  AB38T-32.768KHZ  [XTAL_AB38T-32.768KHZ]

### Blocks framed on the sheet
RTC_DONE: BT1 D19 J25 R30 R31 U7 Y1

### Nets
+5: R30.1 R31.1 U7.8(VCC)  [project net LEDA_]
GND: BT1.2 D19.2(CATHODE) U7.4(GND)
SCL: J25.2 R30.2 U7.6(SCL)
SDA: J25.1 R31.2 U7.5(SDA)
NetBT1_1: BT1.1 U7.3(VBAT)
NetD19_1: D19.1(ANODE) U7.7(SQW/OUT)
NetU7_1: U7.1(X1) Y1.2
NetU7_2: U7.2(X2) Y1.1

### Library data of the parts
BT1 = BATH_CR2032: BATTERY HOLDER, CR2032; MANF_P#: -; .: http://www.chila.ir; VALUE: BAT3volt
D19 = LED_THD_5MM_RED: as D11 on sheet led; MANF: MANF; ASSEMBLY: ASSEMBLY; PRICE: PRICE; VALUE: LED5MM_RED
J25 = HDR_M_1X2: CONN, HEADER, Male, pitch: 2.54mm, 2POS; VALUE: HDRM2
R30 R31 = RES_THD: as R1 on sheet main; ASSEMBLY: ASSEMBLY; PRICE: 100= 0.5$; VALUE: 10K
U7 = DS1307_DIP8: Real-Time Clock, 64 X8, I2C, 56B, Batt; MANF: Maxim Integrated; MANF_P#: DS1307N+; PARAM2: 4.5~5.5V; PARAM: 64 X8, I2C, 56B, Batt, -40~85oC; VALUE: DS1307; PRICE: 3.7$
Y1 = AB38T-32.768KHZ: MP: AB38T-32.768KHZ; Price: None; Package: None; Availability: Unavailable; Value: *

## Sheet rgb_led.SchDoc
size A4; Engineer: Amir Hossein Jobeiri; Organization: Simaran; SheetNumber: 17; SheetTotal: 24
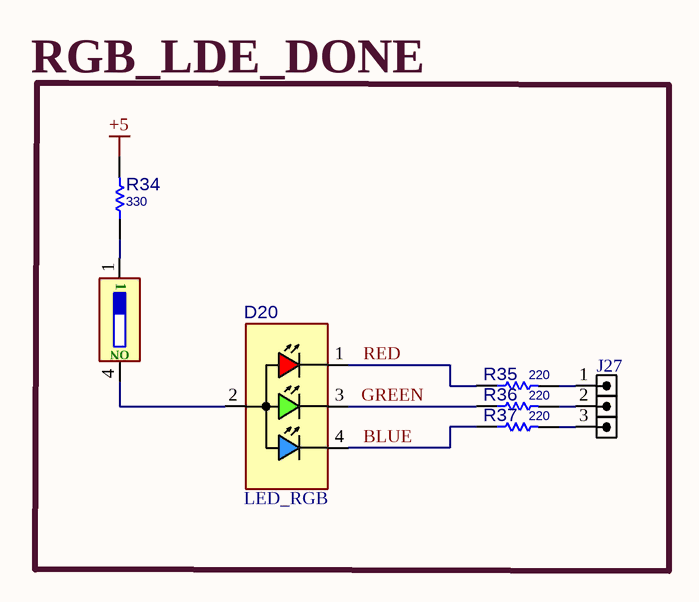
[diagram p16: rgb_led.SchDoc]

### Parts
D20  LED_RGB  [LED5RGB]
J27  HDRM3  [HDR_M_1X3]  (value not drawn)
R34  330  [R025W_AX04]
R35  220  [R025W_AX04]
R36  220  [R025W_AX04]
R37  220  [R025W_AX04]
S3  DIPSW12  [DIPSW254T_1]  (value not drawn)  (part A of 12)

### Blocks framed on the sheet
RGB_LDE_DONE: D20 J27 R34-R37 S3

### Nets
+5: R34.2  [project net LEDA_]
BLUE: D20.4(BLU) R37.1
GREEN: D20.3(GRN) R36.1
RED: D20.1(RED) R35.1
NetD20_2: D20.2(C) S3.4(B1)
NetJ27_1: J27.1 R35.2
NetJ27_2: J27.2 R36.2
NetJ27_3: J27.3 R37.2
NetR34_1: R34.1 S3.1(A1)

### Notes on the sheet
- (in symbol DIPSW254T_12P, part A) ON

### Library data of the parts
D20 = LED_THD_5MM_RGB_CA: LED, THD, 5MM, RGB COMMON CATHODE; MANF_P#: YSL-R596CR3G4B5C-C10; MANF: CHINA YOUNG; DESC: DESCRIPTION; ASSEMBLY: ASSEMBLY; PRICE: PRICE; VALUE: LED_RGB
J27 = HDR_M_1X3: CONN, HEADER, Male, pitch: 2.54mm, 3POS; VALUE: HDRM3
R34-R37 = RES_THD: as R1 on sheet main; ASSEMBLY: ASSEMBLY; PRICE: 100= 0.5$
  R34: VALUE: 330
  R35-R37: VALUE: 220
S3 = DIPSW254T_12P: SWITCH, DIP, 12P, THD; MANF: MANF; MANF_P#: MANF_P#; VALUE: DIPSW12

## Sheet mmc_sd.SchDoc
size A4; Engineer: Amir Hossein Jobeiri; Organization: Simaran; SheetNumber: 18; SheetTotal: 23
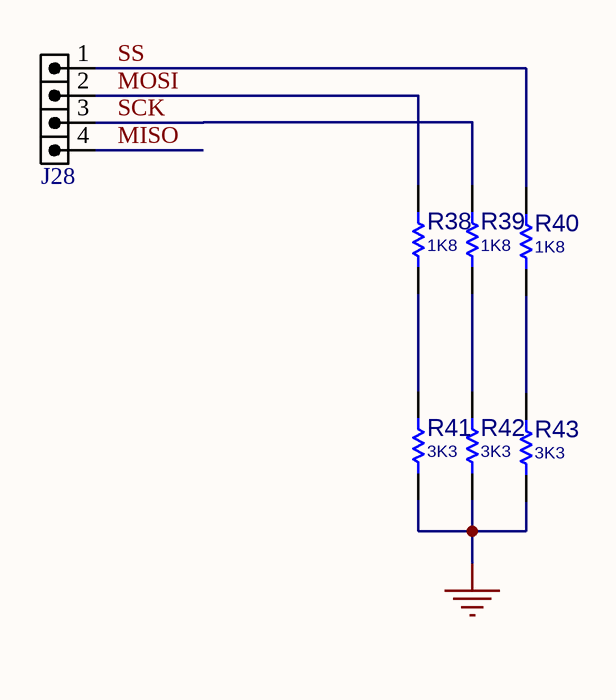
[diagram p17: mmc_sd.SchDoc]

### Parts
J28  HDR1X4  [HDRMINI_M_1X4]  (value not drawn)
R38  1K8  [R025W_AX04]
R39  1K8  [R025W_AX04]
R40  1K8  [R025W_AX04]
R41  3K3  [R025W_AX04]
R42  3K3  [R025W_AX04]
R43  3K3  [R025W_AX04]

### Nets
GND: R41.1 R42.1 R43.1
MISO: J28.4
MOSI: J28.2 R38.2
SCK: J28.3 R39.2
SS: J28.1 R40.2
NetR38_1: R38.1 R41.2
NetR39_1: R39.1 R42.2
NetR40_1: R40.1 R43.2

### Library data of the parts
J28 = HDRMINI_M_1X4: as J2 on sheet stepper_motor
R38-R43 = RES_THD: as R1 on sheet main; ASSEMBLY: ASSEMBLY; PRICE: 100= 0.5$
  R38-R40: VALUE: 1K8
  R41-R43: VALUE: 3K3

## Sheet ps2_connector.SchDoc
size A4; Engineer: Amir Hossein Jobeiri; Organization: Simaran; SheetNumber: 19; SheetTotal: 23
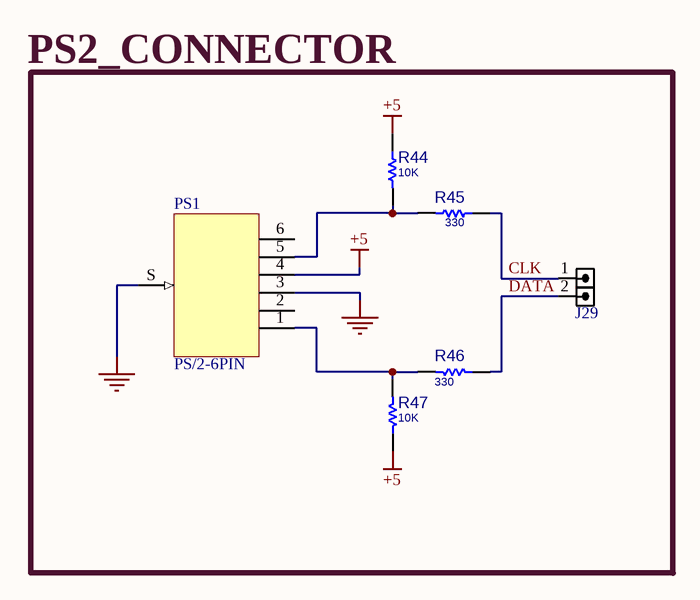
[diagram p18: ps2_connector.SchDoc]

### Parts
J29  HDRMINI_2  [HDRMINI_M_1X2]  (value not drawn)
PS1  PS/2-6PIN
R44  10K  [R025W_AX04]
R45  330  [R025W_AX04]
R46  330  [R025W_AX04]
R47  10K  [R025W_AX04]

### Blocks framed on the sheet
PS2_CONNECTOR: J29 PS1 R44-R47

### Nets
+5: PS1.4 R44.1 R47.1  [project net LEDA_]
GND: PS1.3 PS1.S
CLK: J29.1 R45.1
DATA: J29.2 R46.1
NetPS1_1: PS1.1 R46.2 R47.2
NetPS1_5: PS1.5 R44.2 R45.2

Not connected (* = marked no-connect by the designer): PS1 2 6

### Library data of the parts
J29 = HDRMINI_M_1X2_1: CONN, HEADER, Male, pitch: 1.27mm, 2POS; VALUE: HDRMINI_2
PS1 = PS/2_CONNECTOR: CREATED BY J; VALUE: PS/2-6PIN; MANF: *; MANF_P#: *; PARAM: *; PARAM1: *
R44-R47 = RES_THD: as R1 on sheet main; ASSEMBLY: ASSEMBLY; PRICE: 100= 0.5$
  R44 R47: VALUE: 10K
  R45 R46: VALUE: 330

## Sheet infra_red.SchDoc
size A4; Engineer: Amir Hossein Jobeiri; Organization: Simaran; SheetNumber: 20; SheetTotal: 24
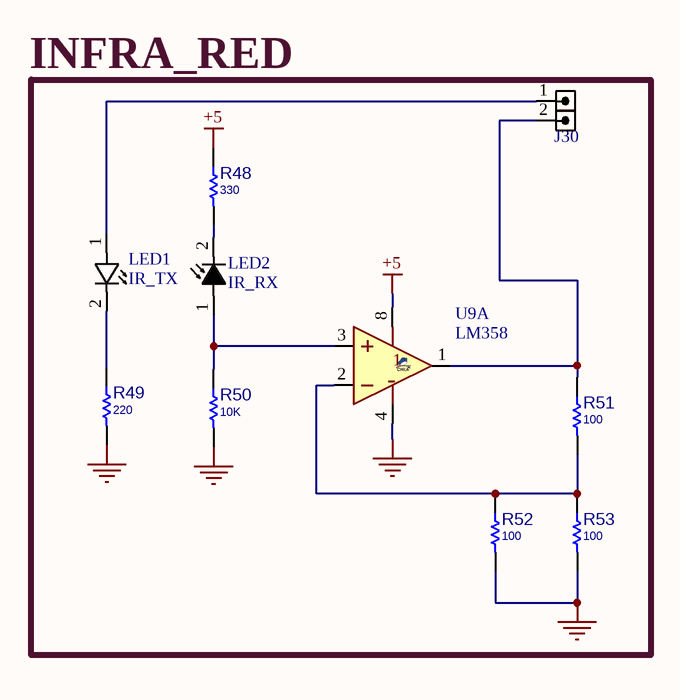
[diagram p19: infra_red.SchDoc]

### Parts
J30  HDRM2  [HDR_M_1X2]  (value not drawn)
LED1  IR_TX  [LED5MM_RED]
LED2  IR_RX  [LED5MM_RED]
R48  330  [R025W_AX04]
R49  220  [R025W_AX04]
R50  10K  [R025W_AX04]
R51  100  [R025W_AX04]
R52  100  [R025W_AX04]
R53  100  [R025W_AX04]
U9  LM358  [DIP_8]  (part A of 2)

### Blocks framed on the sheet
INFRA_RED: J30 LED1 LED2 R48-R53 U9

### Nets
+5: R48.1 U9.8(V+)  [project net LEDA_]
GND: R49.2 R50.2 R52.2 R53.2 U9.4(V-)
NetJ30_1: J30.1 LED1.1(ANODE)
NetJ30_2: J30.2 R51.1 U9.1(OUT)
NetLED1_2: LED1.2(CATHODE) R49.1
NetLED2_1: LED2.1(ANODE) R50.1 U9.3(IN+)
NetLED2_2: LED2.2(CATHODE) R48.2
NetR51_2: R51.2 R52.1 R53.1 U9.2(IN-)

### Library data of the parts
J30 = HDR_M_1X2: CONN, HEADER, Male, pitch: 2.54mm, 2POS; VALUE: HDRM2
LED1 = IR_TX: CREATED BY J; VALUE: IR_TX; PARAM: *; PARAM1: *; MANF: *; MANF_P#: *
LED2 = IR_RX: CREATED BY J; VALUE: IR_RX; PARAM: *; PARAM1: *; MANF: *; MANF_P#: *
R48-R53 = RES_THD: as R1 on sheet main; ASSEMBLY: ASSEMBLY; PRICE: 100= 0.5$
  R48: VALUE: 330
  R49: VALUE: 220
  R50: VALUE: 10K
  R51-R53: VALUE: 100
U9 = LM358_DIP8: AMP, Dual, Low-Power; MANF: Texas Instruments, Fairchild; MANF_P#: LM358AN; PARAM2: 3 V ~ 32 V, ±1.5 V ~ 16 V; PRICE: -; VALUE: LM358

## Sheet digital_pot.SchDoc
size A4; Engineer: Amir Hossein Jobeiri; Organization: Simaran; SheetNumber: 21; SheetTotal: 24
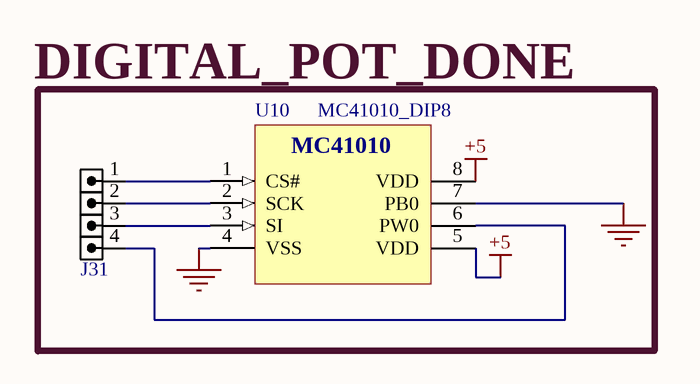
[diagram p20: digital_pot.SchDoc]

### Parts
J31  HDR1X4  [HDR_M_1X4]  (value not drawn)
U10  MC41010_DIP8  [DIP_8]

### Blocks framed on the sheet
DIGITAL_POT_DONE: J31 U10

### Nets
+5: U10.5(VDD) U10.8(VDD)  [project net LEDA_]
GND: U10.4(VSS) U10.7(PB0)
NetJ31_1: J31.1 U10.1(CS#)
NetJ31_2: J31.2 U10.2(SCK)
NetJ31_3: J31.3 U10.3(SI)
NetJ31_4: J31.4 U10.6(PW0)

### Notes on the sheet
- (in symbol MCP41010_DIP8) MC41010

### Library data of the parts
J31 = HDR_M_1X4: as J47 on sheet glcd_128_64
U10 = MCP41010_DIP8: CREATED BY J / Single/Dual Digital Potentiometer with SPI™ Interface; MANF: MICROCHIP; VALUE: MC41010_DIP8; PARAM: *; PARAM1: *; MANF_P#: *

## Sheet phase_locked_loop.SchDoc
size A4; Engineer: Amir Hossein Jobeiri; Organization: Simaran; SheetNumber: 22; SheetTotal: 24
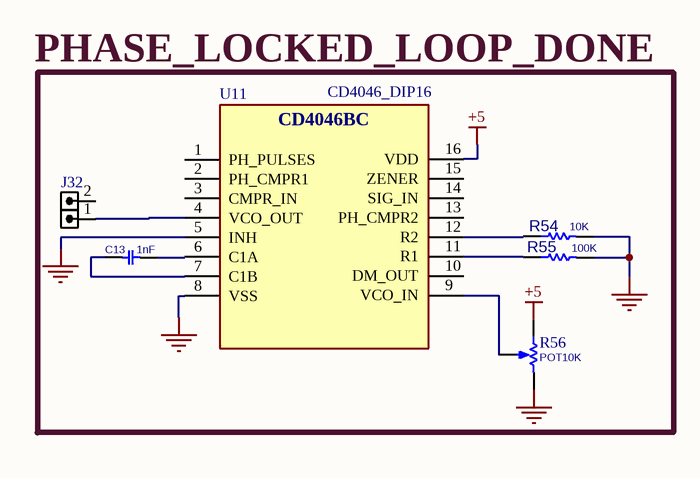
[diagram p21: phase_locked_loop.SchDoc]

### Parts
C13  1nF  [C_CER_D3]
J32  HDRM2  [HDR_M_1X2]  (value not drawn)
R54  10K  [R025W_AX04]
R55  100K  [R025W_AX04]
R56  POT10K  [POT_3296W]
U11  CD4046_DIP16  [DIP_16]

### Blocks framed on the sheet
PHASE_LOCKED_LOOP_DONE: C13 J32 R54-R56 U11

### Nets
+5: R56.1(TOP) U11.16(VDD)  [project net LEDA_]
GND: R54.2 R55.2 R56.3(BOT) U11.5(INH) U11.8(VSS)
NetC13_1: C13.1 U11.7(C1B)
NetC13_2: C13.2 U11.6(C1A)
NetJ32_1: J32.1 U11.4(VCO_OUT)
NetR54_1: R54.1 U11.12(R2)
NetR55_1: R55.1 U11.11(R1)
NetR56_2: R56.2(TAP) U11.9(VCO_IN)

Not connected (* = marked no-connect by the designer): J32 2; U11 1(PH_PULSES) 2(PH_CMPR1) 3(CMPR_IN) 10(DM_OUT) 13(PH_CMPR2) 14(SIG_IN) 15(ZENER)

### Notes on the sheet
- (in symbol CD4046_DIP16) CD4046BC

### Library data of the parts
C13 = CAP_THD_CERML: as C1 on sheet main; PRICE: 100= 1$; MANF: MANF; PARAM2: PARAM2; ASSEMBLY: ASSEMBLY; VALUE: 1nF
J32 = HDR_M_1X2: CONN, HEADER, Male, pitch: 2.54mm, 2POS; VALUE: HDRM2
R54 R55 = RES_THD: as R1 on sheet main; ASSEMBLY: ASSEMBLY; PRICE: 100= 0.5$
  R54: VALUE: 10K
  R55: VALUE: 100K
R56 = RES_THD_POT_3296W: RESISTOR, THD, Potentiometer; VALUE: POT10K
U11 = CD4046_DIP16: CREATED BY J / Micropower Phase-Locked Loop; MANF: FAIRCHILD; VALUE: CD4046_DIP16; PARAM: *; PARAM1: *; MANF_P#: *

## Sheet rs485.SchDoc
size A4; Engineer: Amir Hossein Jobeiri; Organization: Simaran; SheetNumber: 23; SheetTotal: 24
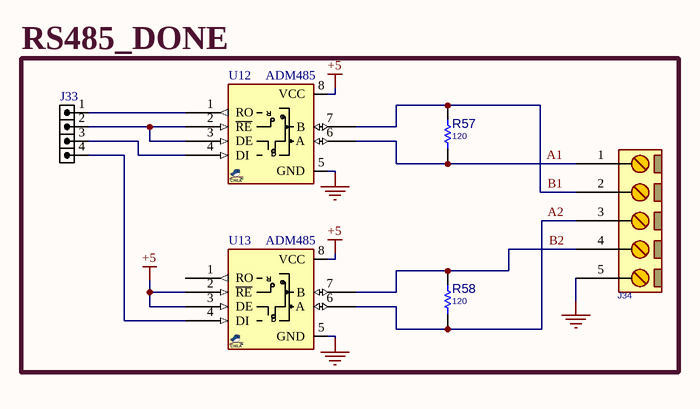
[diagram p22: rs485.SchDoc]

### Parts
J33  HDR1X4  [HDR_M_1X4]  (value not drawn)
J34  CONN_TB5  [TBG_5]  (value not drawn)
R57  120  [R025W_AX04]
R58  120  [R025W_AX04]
U12  ADM485  [DIP_8]
U13  ADM485  [DIP_8]

### Blocks framed on the sheet
RS485_DONE: J33 J34 R57 R58 U12 U13

### Nets
+5: U12.8(VCC) U13.2(~{RE}) U13.3(DE) U13.8(VCC)  [project net LEDA_]
GND: J34.5 U12.5(GND) U13.5(GND)
A1: J34.1 R57.1 U12.6(A)
A2: J34.3 R58.1 U13.6(A)
B1: J34.2 R57.2 U12.7(B)
B2: J34.4 R58.2 U13.7(B)
NetJ33_1: J33.1 U12.1(RO)
NetJ33_2: J33.2 U12.2(~{RE}) U12.3(DE)
NetJ33_3: J33.3 U12.4(DI)
NetJ33_4: J33.4 U13.4(DI)

Not connected (* = marked no-connect by the designer): U13 1(RO)

### Notes on the sheet
- (in symbol ADM485_DIP8) R; D

### Library data of the parts
J33 = HDR_M_1X4: as J47 on sheet glcd_128_64
J34 = CONN_TB5: CONN, TERMINAL BLOCK, 5.08mm pitch; VALUE: CONN_TB5
R57 R58 = RES_THD: as R1 on sheet main; ASSEMBLY: ASSEMBLY; PRICE: 100= 0.5$; VALUE: 120
U12 U13 = ADM485_DIP8: RS-485 Transceiver, 5V, DIP-8, ±7V Ground Difference Between Devices on the Bus; MANF_P#: ADM485AN; MANF: Analog Devices; PRICE: 4000toman@PAYA; VALUE: ADM485